# EAGLE design Displayboard (EAGLE 6.1)
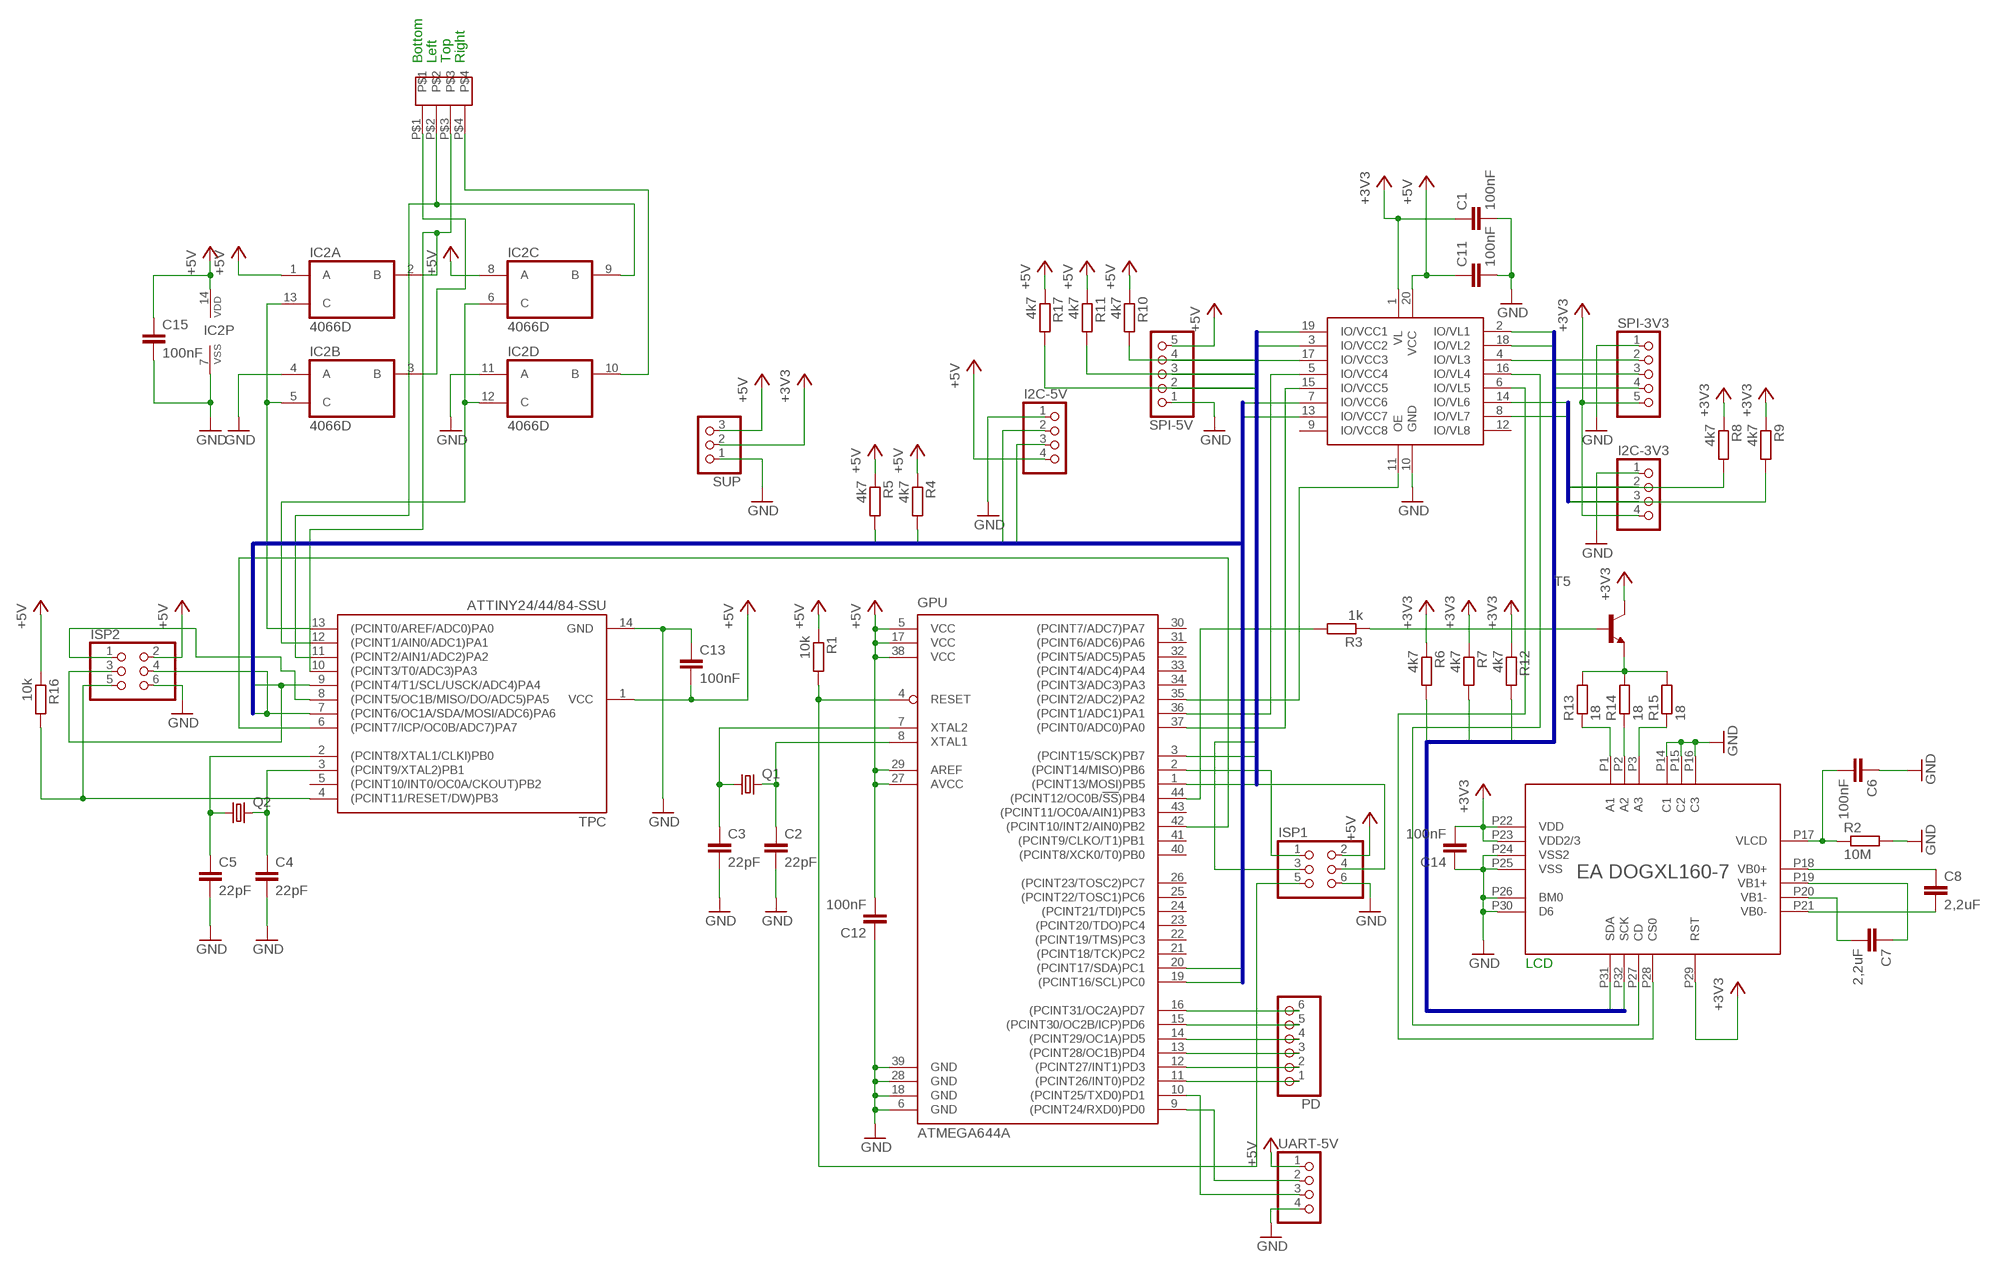
[diagram p0: schematic, sheet 1]

## Parts
C1  100nF  C-EUC1206  [C1206]
C2  22pF  C-EUC1206  [C1206]
C3  22pF  C-EUC1206  [C1206]
C4  22pF  C-EUC1206  [C1206]
C5  22pF  C-EUC1206  [C1206]
C6  100nF  C-EUC1206  [C1206]
C7  2,2uF  C-EUC1206  [C1206]
C8  2,2uF  C-EUC1206  [C1206]
C11  100nF  C-EUC1206  [C1206]
C12  100nF  C-EUC1206  [C1206]
C13  100nF  C-EUC1206  [C1206]
C14  100nF  C-EUC1206  [C1206]
C15  100nF  C-EUC1206  [C1206]
EADOGXL160-7  DOGXL  [DOGXL]
GPU  ATMEGA644A  [TQFP44]
I2C-3V3  PINHD-1X4/90  [1X04/90]
I2C-5V  PINHD-1X4/90  [1X04/90]
IC1  ST2378  [TSSOP-20]
IC2  4066D  [SO14]
ISP1  PINHD-2X3/90  [2X03/90]
ISP2  PINHD-2X3/90  [2X03/90]
PD  PINHD-1X6/90  [1X06/90]
Q1  CRYSTALHC49UP  [HC49UP]
Q2  CRYSTALHC49UP  [HC49UP]
R1  10k  R-EU_R1206  [R1206]
R2  10M  R-EU_R1206  [R1206]
R3  1k  R-EU_R1206  [R1206]
R4  4k7  R-EU_R1206  [R1206]
R5  4k7  R-EU_R1206  [R1206]
R6  4k7  R-EU_R1206  [R1206]
R7  4k7  R-EU_R1206  [R1206]
R8  4k7  R-EU_R1206  [R1206]
R9  4k7  R-EU_R1206  [R1206]
R10  4k7  R-EU_R1206  [R1206]
R11  4k7  R-EU_R1206  [R1206]
R12  4k7  R-EU_R1206  [R1206]
R13  18  R-EU_R1206  [R1206]
R14  18  R-EU_R1206  [R1206]
R15  18  R-EU_R1206  [R1206]
R16  10k  R-EU_R1206  [R1206]
R17  4k7  R-EU_R1206  [R1206]
SPI-3V3  PINHD-1X5/90  [1X05/90]
SPI-5V  PINHD-1X5/90  [1X05/90]
SUP  PINHD-1X3/90  [1X03/90]
T5  BCX19-NPN-SOT23-BEC  [SOT23-BEC]
TPC  ATTINY24/44/84-SSU  [SOIC14]
U$1  ZIF-4-1  [ZIF-4-1]
UART-5V  PINHD-1X4/90  [1X04/90]

## Nets
+3V3: C1.1 C14.2 EADOGXL160-7.P22(VDD) EADOGXL160-7.P23(VDD2/3) EADOGXL160-7.P29(RST) I2C-3V3.4 IC1.1(VL) R6.1 R7.1 R8.1 R9.1 R12.1 SPI-3V3.5 SUP.2 T5.C
+5V: C11.1 C12.2 C13.2 C15.1 GPU.5(VCC) GPU.17(VCC) GPU.27(AVCC) GPU.29(AREF) GPU.38(VCC) I2C-5V.4 IC1.20(VCC) IC2.1(A:A) IC2.8(C:A) IC2.14(P:VDD) ISP1.2 ISP2.2 R1.1 R4.1 R5.1 R10.1 R11.1 R16.1 R17.1 SPI-5V.5 SUP.3 TPC.1(VCC) UART-5V.1
GND: C1.2 C2.2 C3.2 C4.2 C5.2 C6.1 C11.2 C12.1 C13.1 C14.1 C15.2 EADOGXL160-7.P14(C1) EADOGXL160-7.P15(C2) EADOGXL160-7.P16(C3) EADOGXL160-7.P24(VSS2) EADOGXL160-7.P25(VSS) EADOGXL160-7.P26(BM0) EADOGXL160-7.P30(D6) GPU.6(GND) GPU.18(GND) GPU.28(GND) GPU.39(GND) I2C-3V3.1 I2C-5V.1 IC1.10(GND) IC2.4(B:A) IC2.7(P:VSS) IC2.11(D:A) ISP1.6 ISP2.6 R2.2 SPI-3V3.1 SPI-5V.1 SUP.1 TPC.14(GND) UART-5V.4
MISO: GPU.2((PCINT14/MISO)PB6) IC1.3(IO/VCC2) ISP1.1 R10.2 SPI-5V.4
MISO3: IC1.18(IO/VL2) R6.2 SPI-3V3.4
MOSI: GPU.1((PCINT13/MOSI)PB5) IC1.17(IO/VCC3) ISP1.4 R11.2 SPI-5V.3
MOSI3: EADOGXL160-7.P31(SDA) IC1.4(IO/VL3) R7.2 SPI-3V3.3
N$1: C3.1 GPU.7(XTAL2) Q1.1
N$2: C2.1 GPU.8(XTAL1) Q1.2
N$3: GPU.4(RESET) ISP1.5 R1.2
N$4: C5.1 Q2.1 TPC.2((PCINT8/XTAL1/CLKI)PB0)
N$5: C4.1 Q2.2 TPC.3((PCINT9/XTAL2)PB1)
N$6: C6.2 EADOGXL160-7.P17(VLCD) R2.1
N$7: IC2.2(A:B) TPC.10((PCINT3/T0/ADC3)PA3) U$1.P$3
N$8: C8.1 EADOGXL160-7.P18(VB0+)
N$9: C7.1 EADOGXL160-7.P19(VB1+)
N$10: C7.2 EADOGXL160-7.P20(VB1-)
N$11: C8.2 EADOGXL160-7.P21(VB0-)
N$12: GPU.36((PCINT1/ADC1)PA1) IC1.5(IO/VCC4)
N$13: IC2.9(C:B) TPC.11((PCINT2/AIN1/ADC2)PA2) U$1.P$2
N$14: IC2.3(B:B) U$1.P$1
N$15: GPU.16((PCINT31/OC2A)PD7) PD.6
N$16: IC2.5(B:C) IC2.13(A:C) TPC.13((PCINT0/AREF/ADC0)PA0)
N$17: IC2.6(C:C) IC2.12(D:C) TPC.12((PCINT1/AIN0/ADC1)PA1)
N$18: IC2.10(D:B) U$1.P$4
N$19: GPU.42((PCINT10/INT2/AIN0)PB2) TPC.6((PCINT7/ICP/OC0B/ADC7)PA7)
N$20: GPU.15((PCINT30/OC2B/ICP)PD6) PD.5
N$21: GPU.14((PCINT29/OC1A)PD5) PD.4
N$22: EADOGXL160-7.P27(CD) IC1.16(IO/VL4)
N$23: GPU.13((PCINT28/OC1B)PD4) PD.3
N$24: EADOGXL160-7.P28(CS0) IC1.6(IO/VL5)
N$25: GPU.37((PCINT0/ADC0)PA0) IC1.15(IO/VCC5)
N$26: GPU.12((PCINT27/INT1)PD3) PD.2
N$27: GPU.35((PCINT2/ADC2)PA2) IC1.11(OE)
N$28: GPU.11((PCINT26/INT0)PD2) PD.1
N$29: GPU.10((PCINT25/TXD0)PD1) UART-5V.3
N$30: GPU.9((PCINT24/RXD0)PD0) UART-5V.2
N$31: R3.1 T5.B
N$33: EADOGXL160-7.P3(A3) R15.1
N$34: EADOGXL160-7.P2(A2) R14.1
N$35: EADOGXL160-7.P1(A1) R13.1
N$36: R13.2 R14.2 R15.2 T5.E
N$37: ISP2.5 R16.2 TPC.4((PCINT11/RESET/DW)PB3)
N$38: GPU.44((PCINT12/OC0B/!SS!)PB4) R3.2
N$39: ISP2.1 TPC.8((PCINT5/OC1B/MISO/DO/ADC5)PA5)
SCK: GPU.3((PCINT15/SCK)PB7) IC1.19(IO/VCC1) ISP1.3 R17.2 SPI-5V.2
SCK3: EADOGXL160-7.P32(SCK) IC1.2(IO/VL1) R12.2 SPI-3V3.2
SCL: GPU.19((PCINT16/SCL)PC0) I2C-5V.2 IC1.7(IO/VCC6) ISP2.3 R5.2 TPC.9((PCINT4/T1/SCL/USCK/ADC4)PA4)
SCL3: I2C-3V3.2 IC1.14(IO/VL6) R8.2
SDA: GPU.20((PCINT17/SDA)PC1) I2C-5V.3 IC1.13(IO/VCC7) ISP2.4 R4.2 TPC.7((PCINT6/OC1A/SDA/MOSI/ADC6)PA6)
SDA3: I2C-3V3.3 IC1.8(IO/VL7) R9.2
Unconnected: GPU.21((PCINT18/TCK)PC2) GPU.22((PCINT19/TMS)PC3) GPU.23((PCINT20/TDO)PC4) GPU.24((PCINT21/TDI)PC5) GPU.25((PCINT22/TOSC1)PC6) GPU.26((PCINT23/TOSC2)PC7) GPU.30((PCINT7/ADC7)PA7) GPU.31((PCINT6/ADC6)PA6) GPU.32((PCINT5/ADC5)PA5) GPU.33((PCINT4/ADC4)PA4) GPU.34((PCINT3/ADC3)PA3) GPU.40((PCINT8/XCK0/T0)PB0) GPU.41((PCINT9/CLKO/T1)PB1) GPU.43((PCINT11/OC0A/AIN1)PB3) IC1.9(IO/VCC8) IC1.12(IO/VL8) TPC.5((PCINT10/INT0/OC0A/CKOUT)PB2)

## Buses
SCL,SDA
MISO,MOSI,SCK
SCK3,MISO3,MOSI3
SCL3,SDA3

## Notes on the sheet
- Bottom | Left | Top | Right
- LCD

## Library data of the parts
C1-C8 C11-C15 = rcl:C-EU: CAPACITOR, European symbol
EADOGXL160-7 = max:DOGXL
GPU = atmel:ATMEGA644: 8-bit Microcontroller with 64K Bytes In-System Programmable Flash Source: http://www.atmel.com/dyn/resources/prod_documents/doc2593.pdf; MPN: ATMEGA644PV-10AU; OC_FARNELL: 1455123; OC_NEWARK: 58M3748
I2C-3V3 I2C-5V UART-5V = pinhead:PINHD-1X4: PIN HEADER
IC1 = max:ST2378
IC2 = 40xx:4066: Quad bilateral ANALOG SWITCH
ISP1 ISP2 = pinhead:PINHD-2X3: PIN HEADER
PD = pinhead:PINHD-1X6: PIN HEADER
Q1 Q2 = crystal:CRYSTAL: CRYSTAL
R1-R17 = rcl:R-EU_: RESISTOR, European symbol
SPI-3V3 SPI-5V = pinhead:PINHD-1X5: PIN HEADER
SUP = pinhead:PINHD-1X3: PIN HEADER
T5 = transistor:*-NPN-: NPN Transistror BF959 corrected 2008.03.06
TPC = attiny24_44_84:ATTINY24/44/84
U$1 = max:ZIF-4-1

## Net classes
0 default: width 0.254 mm

## Board
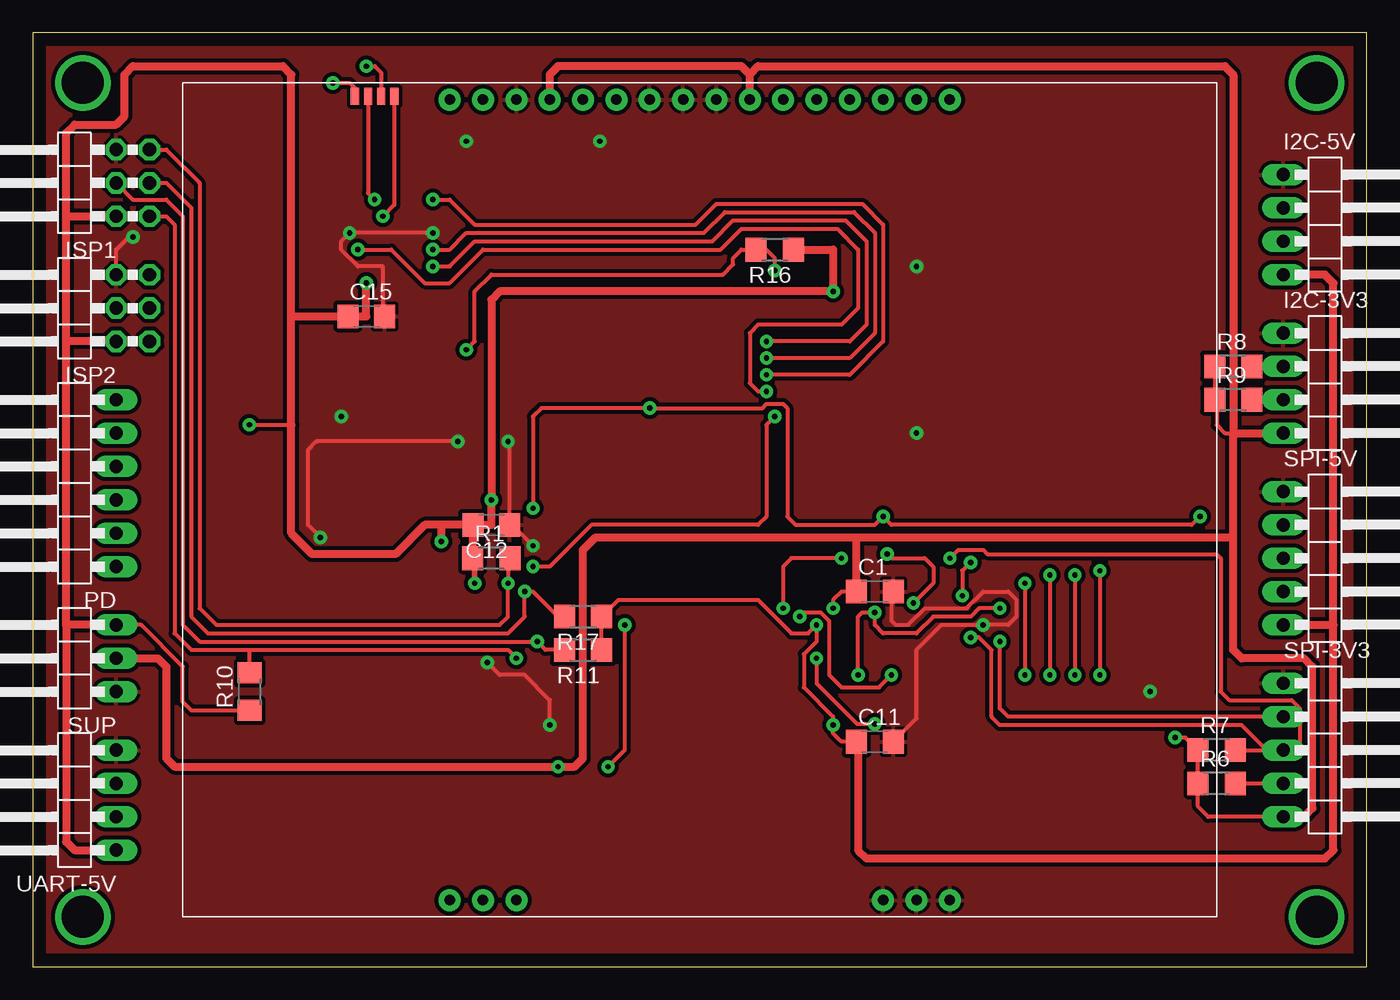
[diagram p1: board, top side]
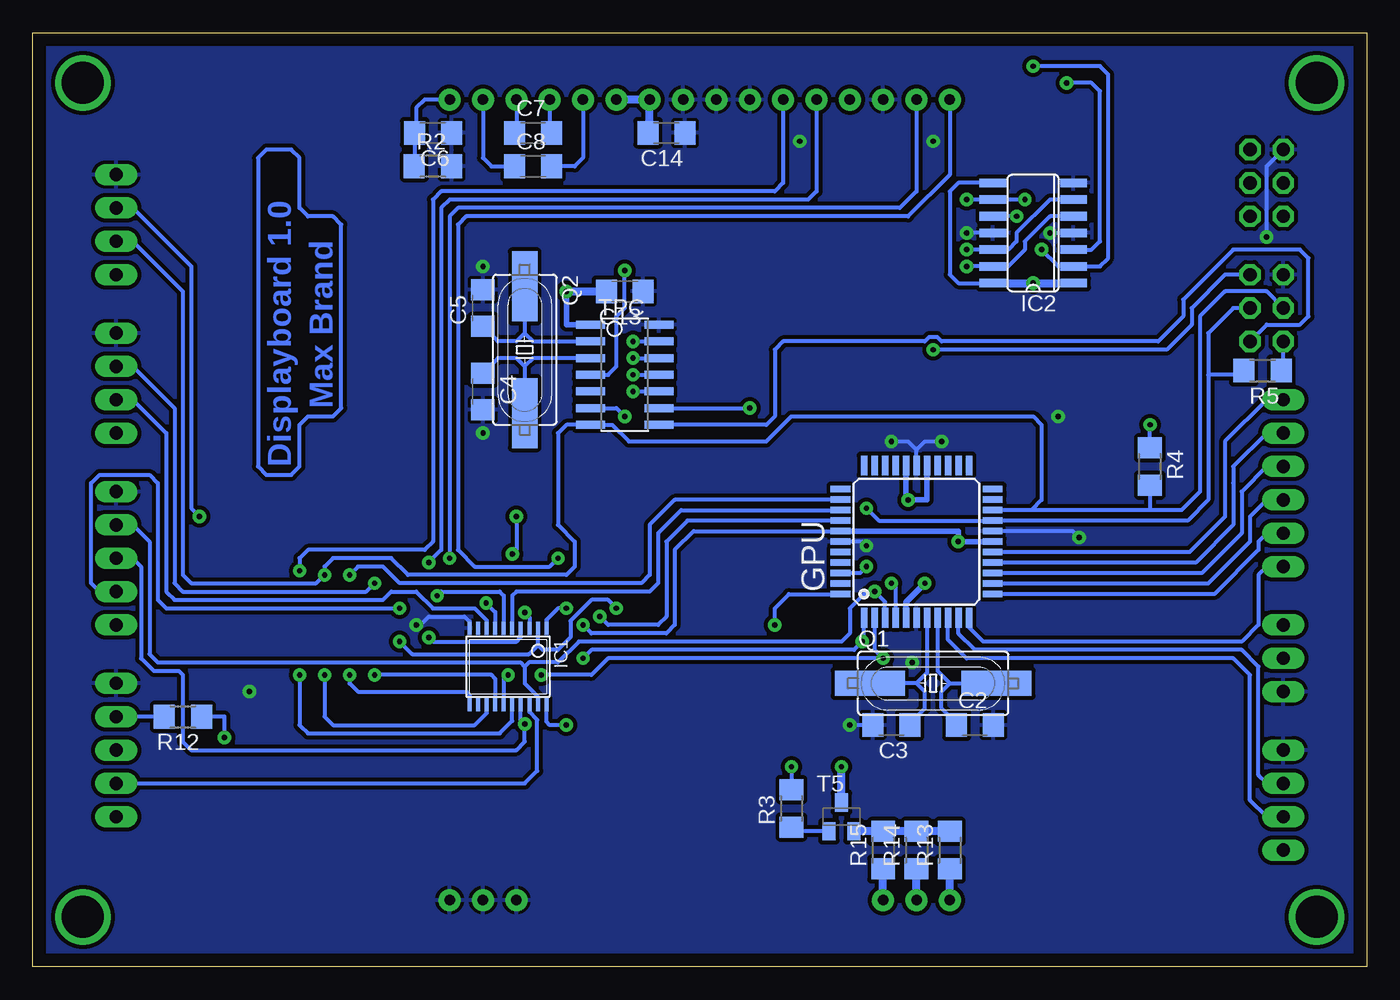
[diagram p2: board, bottom side, seen from below]

Size 101.6 x 71.12 mm. Coordinates in mm from the lower left corner, seen from the top.
Outline: 0,0 101.6,0 101.6,71.12 0,71.12 0,0
Copper layers (1*16): Top 0.035mm / dielectric 1.5mm / Bottom 0.035mm
Design rules: minimum track width 10mil, minimum drill 16mil, track to track 8mil, track to pad 8mil, pad to pad 8mil, via to via 8mil, smd to smd 8mil, copper to edge 40mil, drill to drill 8mil, minimum pad ring 12mil, minimum via ring 12mil, stop-mask expansion 4mil, vias tented up to drill 0mil, thermal gap 10mil

### Footprints (pad centres in the part's own frame; a part is rotated, then mirrored left to right if it is on the bottom)
C1206 = smd 1.6 x 1.8: 1 -1.4,0; 2 1.4,0
DOGXL = drill 0.8 pad 1.676: P1 -19.05,-30.48; P2 -16.51,-30.48; P3 -13.97,-30.48; P14 13.97,-30.48; P15 16.51,-30.48; P16 19.05,-30.48; P17 19.05,30.48; P18 16.51,30.48; P19 13.97,30.48; P20 11.43,30.48; P21 8.89,30.48; P22 6.35,30.48; P23 3.81,30.48; P24 1.27,30.48; P25 -1.27,30.48; P26 -3.81,30.48; P27 -6.35,30.48; P28 -8.89,30.48; P29 -11.43,30.48; P30 -13.97,30.48; P31 -16.51,30.48; P32 -19.05,30.48
TQFP44 = smd 1.5 x 0.5: 1 -5.8,4; 2 -5.8,3.2; 3 -5.8,2.4; 4 -5.8,1.6; 5 -5.8,0.8; 6 -5.8,0; 7 -5.8,-0.8; 8 -5.8,-1.6; 9 -5.8,-2.4; 10 -5.8,-3.2; 11 -5.8,-4; 23 5.8,-4; 24 5.8,-3.2; 25 5.8,-2.4; 26 5.8,-1.6; 27 5.8,-0.8; 28 5.8,0; 29 5.8,0.8; 30 5.8,1.6; 31 5.8,2.4; 32 5.8,3.2; 33 5.8,4 | smd 0.5 x 1.5: 12 -4,-5.8; 13 -3.2,-5.8; 14 -2.4,-5.8; 15 -1.6,-5.8; 16 -0.8,-5.8; 17 0,-5.8; 18 0.8,-5.8; 19 1.6,-5.8; 20 2.4,-5.8; 21 3.2,-5.8; 22 4,-5.8; 34 4,5.8; 35 3.2,5.8; 36 2.4,5.8; 37 1.6,5.8; 38 0.8,5.8; 39 0,5.8; 40 -0.8,5.8; 41 -1.6,5.8; 42 -2.4,5.8; 43 -3.2,5.8; 44 -4,5.8
1X04/90 = drill 1.016 long: 1 -3.81,-3.81; 2 -1.27,-3.81; 3 1.27,-3.81; 4 3.81,-3.81
TSSOP-20 = smd 0.305 x 0.991: 1 -2.925,-2.918; 2 -2.275,-2.918; 3 -1.625,-2.918; 4 -0.975,-2.918; 5 -0.325,-2.918; 6 0.325,-2.918; 7 0.975,-2.918; 8 1.625,-2.918; 9 2.275,-2.918; 10 2.925,-2.918; 11 2.925,2.918; 12 2.275,2.918; 13 1.625,2.918; 14 0.975,2.918; 15 0.325,2.918; 16 -0.325,2.918; 17 -0.975,2.918; 18 -1.625,2.918; 19 -2.275,2.918; 20 -2.925,2.918
SO14 = smd 0.66 x 2.032: 1 -3.81,-3.073; 2 -2.54,-3.073; 3 -1.27,-3.073; 4 0,-3.073; 5 1.27,-3.073; 6 2.54,-3.073; 7 3.81,-3.073; 8 3.81,3.073; 9 2.54,3.073; 10 1.27,3.073; 11 0,3.073; 12 -1.27,3.073; 13 -2.54,3.073; 14 -3.81,3.073
2X03/90 = drill 1.016 octagon: 1 -2.54,-6.35; 2 -2.54,-3.81; 3 0,-6.35; 4 0,-3.81; 5 2.54,-6.35; 6 2.54,-3.81
1X06/90 = drill 1.016 long: 1 -6.35,-3.81; 2 -3.81,-3.81; 3 -1.27,-3.81; 4 1.27,-3.81; 5 3.81,-3.81; 6 6.35,-3.81
HC49UP = smd 5.334 x 1.93: 1 -4.826,0; 2 4.826,0
R1206 = smd 1.6 x 1.803: 1 -1.422,0; 2 1.422,0
1X05/90 = drill 1.016 long: 1 -5.08,-3.81; 2 -2.54,-3.81; 3 0,-3.81; 4 2.54,-3.81; 5 5.08,-3.81
1X03/90 = drill 1.016 long: 1 -2.54,-3.81; 2 0,-3.81; 3 2.54,-3.81
SOT23-BEC = smd 1 x 1.4: B -0.95,-1.1; C 0,1.1; E 0.95,-1.1
SOIC14 = smd 0.61 x 2.21: 1 -3.81,-2.603; 2 -2.54,-2.603; 3 -1.27,-2.603; 4 0,-2.603; 5 1.27,-2.603; 6 2.54,-2.603; 7 3.81,-2.603; 8 3.81,2.603; 9 2.54,2.603; 10 1.27,2.603; 11 0,2.603; 12 -1.27,2.603; 13 -2.54,2.603; 14 -3.81,2.603
ZIF-4-1 = smd 0.635 x 1.27: P$1 -1.5,0; P$2 -0.5,0; P$3 0.5,0; P$4 1.5,0

### Placement (x,y rotation side)
C1  64.14,28.57 0 top
C2  29.84,18.41 0 bottom
C3  36.2,18.41 180 bottom
C4  67.31,43.81 270 bottom
C5  67.31,50.16 90 bottom
C6  71.12,63.5 180 bottom
C7  63.5,63.5 0 bottom
C8  63.5,60.96 0 bottom
C11  64.14,17.14 0 top
C12  34.92,33.66 180 top
C13  56.52,51.44 180 bottom
C14  53.34,63.5 180 bottom
C15  25.4,49.53 0 top
EADOGXL160-7  50.8,35.56 0 top
GPU  34.29,32.38 90 bottom
I2C-3V3  99.06,44.45 270 top
I2C-5V  99.06,56.52 270 top
IC1  65.41,22.86 180 bottom
IC2  25.4,55.88 90 bottom
ISP1  2.54,59.69 90 top
ISP2  2.54,50.16 90 top
PD  2.54,36.83 90 top
Q1  33.02,21.59 0 bottom
Q2  64.14,46.99 270 bottom
R1  34.92,31.11 0 top
R2  71.12,60.96 0 bottom
R3  43.81,12.06 90 bottom
R4  16.51,38.1 270 bottom
R5  7.94,45.4 180 bottom
R6  90.17,13.97 0 top
R7  90.17,16.51 0 top
R8  91.44,45.72 0 top
R9  91.44,43.18 0 top
R10  16.51,20.95 90 top
R11  41.91,24.13 180 top
R12  90.17,19.05 180 bottom
R13  31.75,8.89 90 bottom
R14  34.29,8.89 90 bottom
R15  36.83,8.89 90 bottom
R16  56.52,54.61 180 top
R17  41.91,26.67 180 top
SPI-3V3  99.06,16.51 270 top
SPI-5V  99.06,31.11 270 top
SUP  2.54,23.5 90 top
T5  40.01,11.43 0 bottom
TPC  56.52,45.09 270 bottom
U$1  26.04,66.29 0 top
UART-5V  2.54,12.7 90 top

### Tracks (layer width: path | path; a pad name or v marks a point on that pad's centre or on a via)
+3V3  (via drill 0.41, 0.41 pad 0.41)
  Top 0.305: C1.1 61.59,28.57 60.96,27.94 v60.96,27.3 | R8.1 R9.1 90.17,43.03 90.17,41.27 90.81,40.64 91.44,40.64 | v87,17.46 87.8,17.46 R7.1 R6.1 88.75,12.22 89.53,11.43 96.84,11.43
  Top 0.61: 54.61,67.94 55.24,68.58 90.81,68.58 91.44,67.94 91.44,40.64 | 91.44,40.64 I2C-3V3.4 | SPI-3V3.5 96.84,11.43 97.47,12.06 97.47,22.86 96.84,23.5 92.08,23.5 91.44,24.13 91.44,32.7 | 91.44,32.7 91.44,40.64 | C1.1 62.73,32.7 | 62.73,32.7 91.44,32.7 | SUP.2 9.53,23.5 10.16,22.86 10.16,15.88 10.79,15.24 v40.01,15.24 41.27,15.24 41.91,15.88 41.91,31.75 42.86,32.7 62.73,32.7 | EADOGXL160-7.P23 54.61,67.94 | 54.61,67.94 53.98,68.58 40.01,68.58 39.37,67.94 EADOGXL160-7.P29
  Bottom 0.305: v60.96,27.3 61.59,27.3 62.48,26.42 IC1.1 | v87,17.46 87,19.05 R12.1
  Bottom 0.61: T5.C v40.01,15.24 | C14.2 54.61,63.63 EADOGXL160-7.P23 EADOGXL160-7.P22
+5V  (via drill 0.41, 0.41 pad 0.41)
  Top 0.305: C11.1 61.59,17.14 60.96,17.78 v60.96,18.41 60.96,19.05 58.74,21.27 58.74,23.81 59.69,24.77 v59.69,26.04 59.05,25.4 57.78,25.4 55.24,27.94 44.6,27.94 R17.1 R11.1 | SUP.3 8.26,26.04 11.43,22.86 11.43,20.17 12.06,19.53 R10.1 | v16.51,41.27 19.68,41.27
  Top 0.406: R1.1 33.66,30.96 v33.66,29.21
  Top 0.61: 2.54,26.04 2.54,9.53 3.17,8.89 UART-5V.1 | SUP.3 2.54,26.04 | 2.54,26.04 2.54,47.62 | 2.54,47.62 2.54,57.15 | 2.54,57.15 ISP1.2 | ISP2.2 2.54,47.62 | 2.54,57.15 2.54,63.5 3.17,64.14 6.35,64.14 6.99,64.77 6.99,67.94 7.62,68.58 19.05,68.58 19.68,67.94 19.68,49.53 | 19.68,49.53 C15.1 25.4,49.53 v25.4,52.07 | 31.11,33.66 29.84,33.66 27.62,31.43 21.27,31.43 19.68,33.02 19.68,41.27 19.68,49.53 | 33.5,33.66 R1.1 | 33.5,33.66 C12.2 34.92,33.66 v34.92,35.56 34.92,50.8 35.56,51.44 v60.96,51.44 60.96,54.61 R16.1 | 33.5,33.66 31.11,33.66 | 31.11,33.66 v31.11,32.38 | SPI-5V.5 99.06,26.04 | 99.06,26.04 99.06,52.07 98.42,52.7 I2C-5V.4 | C11.1 62.87,17.14 62.87,8.89 63.5,8.26 98.42,8.26 99.06,8.89 99.06,26.04
  Bottom 0.305: v59.69,26.04 59.05,25.4 53.34,25.4 52.7,26.04 52.7,31.75 51.27,33.19 GPU.38 | v60.96,18.41 62.23,18.41 62.48,18.66 IC1.20 | IC2.8 31.11,59.69 31.75,59.05 31.75,52.7 31.11,52.07 IC2.14 | R5.1 6.35,45.57 ISP2.2 | R4.1 v16.51,41.27
  Bottom 0.406: GPU.17 v31.11,32.38 31.11,33.19 GPU.38 | GPU.29 35.09,35.56 v34.92,35.56 33.49,35.56 GPU.27 | TPC.1 60.96,48.9 v60.96,51.44 | v33.66,29.21 35.09,27.77 GPU.5
  Bottom 0.61: IC2.1 v25.4,52.07 IC2.14 | v60.96,51.44 C13.2
GND  (via drill 0.41)
  Top 0.305: v38.1,32.07 36.83,33.34 36.83,33.66 C12.1 36.33,39.88 v36.2,40.01 | C1.2 65.41,28.57 65.41,26.35 65.72,26.04 66.67,26.04 67.94,27.3 71.12,27.3 72.39,28.57 74.3,28.57 74.93,27.94 74.93,26.67 74.3,26.04 v72.39,26.04 69.22,26.04 67.31,24.13 67.31,18.92 C11.2 | C15.2 26.67,49.66 26.67,53.34 24.77,53.34 23.5,54.61 23.5,55.24 v24.13,55.88 v30.48,55.88 | v32.38,40.01 21.59,40.01 20.95,39.37 20.95,33.66 v21.91,32.7 | ISP2.6 6.35,54.61 7.3,55.56 v7.62,55.56 | v39.37,18.41 39.37,20.32 37.47,22.23 35.56,22.23 v34.61,23.18
  Bottom 0.305: v36.2,40.01 34.92,40.01 34.29,39.37 | v24.13,55.88 IC2.4 | IC2.11 v30.48,55.88 | GPU.28 34.29,39.37 | 34.29,39.37 33.66,40.01 v32.38,40.01 | v21.91,32.7 22.39,33.19 GPU.18 | v38.1,32.07 38.42,32.38 GPU.39 | v72.39,26.04 72.07,26.04 71.44,26.67 68.72,26.67 68.33,26.29 IC1.10 | v7.62,55.56 7.62,60.96 ISP1.6 | C3.2 v39.37,18.41
  other vias: 67.31,40.64 67.31,53.34 23.5,41.91 85.09,20.95 33.02,62.87 43.18,62.87
  pour Top (isolate 0.305): 0,71.12 101.6,71.12 101.6,0 0,0
  pour Bottom (isolate 0.305): 0,71.12 101.6,71.12 101.6,0 0,0
MISO  (via drill 0.41 pad 0.41)
  Top 0.305: ISP1.1 10.16,57.15 10.79,56.52 10.79,25.4 12.06,24.13 16.51,24.13 | 16.51,24.13 36.2,24.13 v36.83,23.5 | v62.87,22.23 62.87,26.67 63.18,26.99 v64.14,26.99 64.14,26.04 64.77,25.4 67.31,25.4 68.58,26.67 71.44,26.67 72.07,27.3 v73.66,27.3 | R10.2 16.51,24.13
  Bottom 0.305: GPU.2 37.49,24.16 v36.83,23.5 57.78,23.5 59.05,22.23 v62.87,22.23 | v64.14,26.99 63.78,26.63 IC1.3 | SPI-5V.4 96.52,28.57 97.16,29.21 97.16,36.83 96.52,37.47 92.71,37.47 92.08,36.83 92.08,27.94 91.44,27.3 v73.66,27.3
MISO3
  Top 0.305: R6.2 SPI-3V3.4
  Bottom 0.305: SPI-3V3.4 64.14,13.97 63.18,14.92 63.18,18.81 63.78,19.41 IC1.18
MOSI  (via drill 0.41 pad 0.41)
  Top 0.305: ISP1.4 7.62,58.42 10.16,58.42 11.43,57.15 11.43,26.04 12.7,24.77 v38.42,24.77 39.05,24.13 R11.2 | v59.69,23.5 59.69,21.59 62.79,18.49 v64.14,18.49
  Bottom 0.305: v59.69,23.5 59.05,24.13 39.05,24.13 v38.42,24.77 38.29,24.89 GPU.1 | IC1.17 64.43,18.79 v64.14,18.49 64.14,17.14 64.77,16.51 89.53,16.51 90.17,17.14 90.17,22.23 90.49,22.54 92.39,22.54 93.34,23.5 93.34,30.48 93.98,31.11 SPI-5V.3
MOSI3  (via drill 0.41)
  Top 0.305: SPI-3V3.3 93.98,16.51 92.08,18.41 73.66,18.41 73.03,19.05 73.03,24.13 72.07,25.08 v71.44,25.08 | v69.85,31.11 70.48,31.75 72.39,31.75 72.71,31.43 90.17,31.43 90.49,31.11 90.49,20.95 91.12,20.32 95.89,20.32 96.52,19.68 96.52,17.14 95.89,16.51 SPI-3V3.3 | R7.2 SPI-3V3.3
  Bottom 0.305: v71.44,25.08 71.12,24.77 64.77,24.77 64.43,25.11 IC1.4 | EADOGXL160-7.P31 34.29,59.05 35.56,57.78 69.22,57.78 69.85,57.15 v69.85,31.11
N$1
  Bottom 0.305: C3.1 34.8,18.55 33.66,19.68 33.66,20.95 34.29,21.59 | 34.29,21.59 Q1.1 | GPU.7 33.49,22.39 34.29,21.59
N$2
  Bottom 0.305: GPU.8 32.69,22.53 31.75,21.59 | 31.75,21.59 Q1.2 | C2.1 31.25,18.55 32.38,19.68 32.38,20.95 31.75,21.59
N$3  (via drill 0.41 pad 0.41)
  Top 0.305: R1.2 36.2,30.96 v36.2,29.21 36.2,26.67 35.56,26.04 13.97,26.04 12.7,27.3 12.7,59.69 10.16,62.23 ISP1.5
  Bottom 0.305: v36.2,29.21 35.89,28.91 GPU.4
N$4
  Bottom 0.305: Q2.1 64.14,48.26 | 64.14,48.26 63.5,47.62 TPC.2 | 64.14,48.26 64.77,47.62 66.17,47.62 C5.1
N$5
  Bottom 0.305: TPC.3 63.5,46.35 64.14,45.72 | 64.14,45.72 Q2.2 | 64.14,45.72 64.77,46.35 66.17,46.35 C4.1 67.31,45.72
N$6
  Bottom 0.305: EADOGXL160-7.P17 71.75,66.04 72.39,65.41 72.39,63.63 C6.2 72.52,60.98 R2.1
N$7  (via drill 0.41)
  Top 0.305: v25.4,68.58 26.04,68.58 26.54,68.08 U$1.P$3 | v24.77,54.61 27.3,54.61 29.84,52.07 31.75,52.07 34.29,54.61 52.39,54.61 53.98,56.2 61.28,56.2 62.87,54.61 62.87,50.16 61.59,48.9 55.24,48.9 54.61,48.26 54.61,44.45 55.24,43.81 v55.88,43.81
  Bottom 0.305: v25.4,68.58 20.32,68.58 19.68,67.94 19.68,53.98 20.32,53.34 IC2.2 23.5,53.34 v24.77,54.61 | v55.88,43.81 TPC.10
N$8
  Bottom 0.305: EADOGXL160-7.P18 67.31,61.59 66.67,60.96 C8.1
N$9
  Bottom 0.305: EADOGXL160-7.P19 64.77,63.63 C7.1
N$10
  Bottom 0.305: EADOGXL160-7.P20 62.23,63.63 C7.2
N$11
  Bottom 0.305: EADOGXL160-7.P21 59.69,61.59 60.33,60.96 C8.2
N$12
  Bottom 0.305: GPU.36 52.21,34.78 53.98,33.02 53.98,29.21 54.61,28.57 64.77,28.57 65.08,28.27 IC1.5
N$13  (via drill 0.41)
  Top 0.305: U$1.P$2 25.54,58.92 v26.04,58.42 | v30.48,58.42 31.75,58.42 33.66,56.52 50.48,56.52 52.07,58.1 63.18,58.1 64.77,56.52 64.77,47.62 62.23,45.09 v55.88,45.09
  Bottom 0.305: v26.04,58.42 IC2.9 v30.48,58.42 | v55.88,45.09 TPC.11
N$14  (via drill 0.41)
  Top 0.305: v22.86,67.31 24.13,67.31 24.54,66.91 U$1.P$1
  Bottom 0.305: IC2.3 20.95,54.61 20.32,55.24 20.32,66.67 20.95,67.31 v22.86,67.31
N$15
  Bottom 0.305: PD.6 7.62,43.18 10.79,40.01 10.79,34.29 13.5,31.59 GPU.16
N$16  (via drill 0.41)
  Top 0.305: v30.48,53.34 31.75,53.34 33.66,55.24 51.75,55.24 53.34,56.83 61.91,56.83 63.5,55.24 63.5,48.9 62.23,47.62 v55.88,47.62
  Bottom 0.305: IC2.5 24.13,57.15 26.04,55.24 26.04,54.61 27.3,53.34 IC2.13 v30.48,53.34 | v55.88,47.62 TPC.13
N$17  (via drill 0.41)
  Top 0.305: v30.48,54.61 31.75,54.61 33.02,55.88 51.12,55.88 52.7,57.47 62.55,57.47 64.14,55.88 64.14,48.26 62.23,46.35 v55.88,46.35
  Bottom 0.305: IC2.6 24.13,58.42 26.67,55.88 26.67,55.24 27.3,54.61 IC2.12 v30.48,54.61 | v55.88,46.35 TPC.12
N$18  (via drill 0.41)
  Top 0.305: U$1.P$4 27.54,58.02 v26.67,57.15
  Bottom 0.305: v26.67,57.15 IC2.10
N$19  (via drill 0.41)
  Top 0.305: v56.52,41.91 55.88,41.27 55.88,34.29 55.24,33.66 42.55,33.66 39.37,30.48 v38.1,30.48
  Bottom 0.305: TPC.6 57.15,42.55 v56.52,41.91 | v38.1,30.48 38.59,29.98 GPU.42
N$20
  Bottom 0.305: PD.5 7.62,40.64 10.16,38.1 10.16,36.83 10.16,33.66 13.03,30.79 GPU.15
N$21
  Bottom 0.305: PD.4 7.62,38.1 9.53,36.2 9.53,33.02 12.56,29.98 GPU.14
N$22  (via drill 0.41)
  Top 0.305: v81.28,30.16 v81.28,22.23
  Bottom 0.305: v81.28,22.23 81.28,18.41 80.64,17.78 66.04,17.78 65.08,18.74 IC1.16 | EADOGXL160-7.P27 44.45,59.69 45.09,59.05 70.48,59.05 71.12,58.42 71.12,32.38 71.75,31.75 80.64,31.75 81.28,31.11 v81.28,30.16
N$23
  Bottom 0.305: PD.3 7.62,35.56 8.89,34.29 8.89,32.38 12.09,29.18 GPU.13
N$24  (via drill 0.41)
  Top 0.305: v71.44,30.8 70.8,30.16 v70.8,28.26
  Bottom 0.305: EADOGXL160-7.P28 41.91,59.05 42.55,58.42 69.85,58.42 70.48,57.78 70.48,31.75 v71.44,30.8 | v70.8,28.26 70.48,28.57 66.04,28.57 65.73,28.27 IC1.6
N$25  (via drill 0.41 pad 0.41)
  Top 0.305: v58.42,26.67 58.74,26.99 60.01,26.99 60.64,26.35 60.64,22.23 61.59,21.27 64.45,21.27 v65.41,22.23
  Bottom 0.305: GPU.37 51.74,33.98 53.34,32.38 53.34,26.67 53.98,26.04 57.78,26.04 v58.42,26.67 | v65.41,22.23 65.73,21.9 IC1.15
N$26
  Bottom 0.305: PD.2 7.62,33.02 8.26,32.38 8.26,31.75 11.62,28.39 GPU.12
N$27  (via drill 0.41)
  Top 0.305: v77.47,29.84 v77.47,22.23
  Bottom 0.305: GPU.35 40.12,35.56 52.7,35.56 54.61,33.66 54.61,29.84 55.24,29.21 73.66,29.21 74.93,30.48 76.83,30.48 v77.47,29.84 | v77.47,22.23 77.47,21.59 76.83,20.95 68.58,20.95 68.33,20.7 IC1.11
N$28
  Bottom 0.305: PD.1 7.62,30.48 8.26,29.84 8.26,26.04 9.53,24.77 29.21,24.77 30.29,25.84 GPU.11
N$29
  Bottom 0.305: UART-5V.3 7.62,13.97 8.26,14.61 8.26,22.86 9.53,24.13 29.84,24.13 31.09,25.38 GPU.10
N$30
  Bottom 0.305: UART-5V.2 7.62,11.43 8.89,12.7 8.89,22.23 10.16,23.5 30.48,23.5 31.89,24.91 GPU.9
N$31
  Bottom 0.305: T5.B 43.81,10.33 R3.1
N$32  (via drill 3.2)
  other vias: 3.81,67.31
N$33
  Bottom 0.61: EADOGXL160-7.P3 R15.1
N$34
  Bottom 0.61: EADOGXL160-7.P2 R14.1
N$35
  Bottom 0.61: EADOGXL160-7.P1 R13.1
N$36
  Bottom 0.61: R13.2 R14.2 R15.2 39.05,10.31 T5.E
N$37  (via drill 0.41, 0.41 pad 0.41)
  Top 0.305: v33.02,46.99 33.66,47.62 33.66,51.44 34.92,52.7 52.55,52.7 53.34,53.49 53.34,53.98 53.98,54.61 R16.2 55.88,54.61 56.52,53.98 v56.52,53.02
  Bottom 0.305: ISP2.5 10.79,52.7 13.34,50.16 13.34,48.9 15.24,46.99 v33.02,46.99 | TPC.4 57.78,45.09 57.15,45.72 57.15,49.53 56.52,50.16 v56.52,53.02
N$38  (via drill 0.41)
  Top 0.305: v45.09,26.04 45.09,16.51 v43.81,15.24
  Bottom 0.305: v43.81,15.24 R3.2 | v45.09,26.04 45.09,27.3 44.01,28.39 GPU.44
N$39
  Bottom 0.305: ISP2.1 7.62,48.9 5.08,48.9 4.45,49.53 4.45,53.98 5.08,54.61 10.16,54.61 13.97,50.8 13.97,49.53 15.88,47.62 32.38,47.62 32.7,47.94 33.34,47.94 33.66,47.62 44.45,47.62 45.09,46.99 45.09,41.91 45.72,41.27 TPC.8
N$40  (via drill 3.2)
  other vias: 97.79,3.81
N$41  (via drill 3.2)
  other vias: 97.79,67.31
N$42  (via drill 3.2)
  other vias: 3.81,3.81
N$43
  Bottom 0.305: 78.74,57.15 80.64,57.15 81.28,57.78 81.28,61.59 81.92,62.23 83.82,62.23 84.45,61.59 84.45,38.1 83.82,37.47 81.92,37.47 81.28,38.1 81.28,41.27 80.64,41.91 78.74,41.91 78.11,42.55 78.11,56.52 78.74,57.15
SCK  (via drill 0.41 pad 0.41)
  Top 0.305: ISP1.3 10.16,59.69 12.06,57.78 12.06,26.67 13.34,25.4 36.2,25.4 37.47,26.67 v37.47,28.57 38.1,28.57 40.01,26.67 R17.2
  Bottom 0.305: GPU.3 36.69,27.8 v37.47,28.57 38.1,28.57 39.37,27.3 39.37,25.4 40.01,24.77 60.01,24.77 61.59,23.18 63.82,23.18 64.14,22.86 | 64.14,22.86 64.14,21.59 63.13,20.59 IC1.19 | SPI-5V.2 93.98,33.66 92.71,32.38 92.71,23.81 92.08,23.18 64.45,23.18 64.14,22.86
SCK3  (via drill 0.41)
  Top 0.305: SPI-3V3.2 74.3,19.05 73.66,19.68 v73.66,24.77 | v61.59,31.11 57.78,31.11 57.15,30.48 v57.15,27.3
  Bottom 0.305: v73.66,24.77 72.71,23.81 63.82,23.81 63.13,24.5 | 63.13,24.5 IC1.2 | EADOGXL160-7.P32 31.75,60.33 34.92,57.15 68.58,57.15 69.22,56.52 69.22,31.75 67.94,30.48 62.23,30.48 v61.59,31.11 | v57.15,27.3 57.78,27.94 59.05,27.94 60.64,26.35 60.64,25.08 61.59,24.13 62.76,24.13 63.13,24.5 | R12.2 SPI-3V3.2
SCL  (via drill 0.41)
  Top 0.305: v38.1,34.92 38.1,41.91 38.73,42.55 v46.99,42.55 55.56,42.55 55.88,42.86 57.15,42.86 57.47,42.55 57.47,34.29 58.1,33.66 64.14,33.66 v64.77,34.29 65.41,33.66 88.27,33.66 v88.9,34.29 | v65.09,31.43 65.41,31.11 67.94,31.11 68.58,30.48 68.58,29.21 v67.07,27.7
  Bottom 0.305: ISP2.3 10.16,50.16 12.06,48.26 12.06,45.09 | 12.06,45.09 12.06,35.56 13.64,33.98 GPU.19 37.16,33.98 v38.1,34.92 | TPC.9 v46.99,42.55 | v64.77,34.29 64.77,31.75 v65.09,31.43 | I2C-5V.2 93.98,57.78 89.53,53.34 89.53,34.92 v88.9,34.29 | v67.07,27.7 66.38,27.01 IC1.7 | R5.2 9.68,45.09 12.06,45.09
SCL3  (via drill 0.41)
  Top 0.305: v75.56,29.21 v75.56,22.23 | R8.2 I2C-3V3.2
  Bottom 0.305: I2C-3V3.2 93.98,45.72 90.81,42.55 90.81,29.21 90.17,28.57 76.2,28.57 v75.56,29.21 | IC1.14 66.38,21.93 66.67,22.23 v75.56,22.23
SDA  (via drill 0.41)
  Top 0.305: v79.38,29.84 v79.38,22.23
  Bottom 0.305: ISP2.4 7.62,51.44 10.79,51.44 12.7,49.53 12.7,36.2 14.11,34.78 16.51,34.78 | 16.51,34.78 25.54,34.78 | v79.38,22.23 79.38,19.05 78.74,18.41 67.94,18.41 67.03,19.33 IC1.13 | I2C-5V.3 93.98,55.24 90.17,51.44 90.17,29.84 89.53,29.21 80.01,29.21 v79.38,29.84 79.38,30.48 78.74,31.11 74.3,31.11 73.03,29.84 60.96,29.84 60.33,30.48 60.33,32.38 61.59,33.66 61.59,40.64 60.96,41.27 TPC.7 57.47,41.27 56.2,40.01 45.72,40.01 43.81,41.91 25.4,41.91 24.77,41.27 24.77,35.56 25.54,34.78 | 25.54,34.78 GPU.20 | R4.2 16.51,34.78
SDA3
  Top 0.305: R9.2 I2C-3V3.3
  Bottom 0.305: I2C-3V3.3 93.98,43.18 91.44,40.64 91.44,28.57 90.81,27.94 74.93,27.94 74.3,28.57 72.39,28.57 71.12,27.3 67.94,27.3 67.03,26.39 IC1.8

### Text on the board
Bottom: Max Brand | Displayboard 1.0